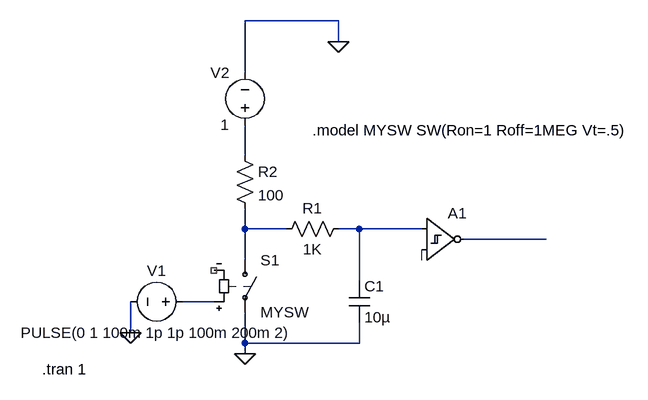
[diagram p0: schematic switch debouncing circuit.asc]
switch debouncing circuit.asc, the LTspice schematic file:
Version 4
SHEET 1 900 680
WIRE 400 -320 256 -320
WIRE 400 -288 400 -320
WIRE 256 -240 256 -320
WIRE 256 -112 256 -160
WIRE 256 0 256 -32
WIRE 320 0 256 0
WIRE 432 0 400 0
WIRE 528 0 432 0
WIRE 720 16 592 16
WIRE 256 48 256 0
WIRE 432 80 432 0
WIRE 208 112 160 112
WIRE 80 160 80 112
WIRE 256 176 256 128
WIRE 432 176 432 144
WIRE 432 176 256 176
WIRE 256 192 256 176
FLAG 80 160 0
FLAG 256 192 0
FLAG 400 -288 0
SYMBOL voltage 176 112 R90
WINDOW 0 -32 56 VBottom 2
WINDOW 3 32 56 VTop 2
WINDOW 123 0 0 Left 0
WINDOW 39 0 0 Left 0
SYMATTR InstName V1
SYMATTR Value PULSE(0 1 100m 1p 1p 100m 200m 2)
SYMBOL cap 416 80 R0
SYMATTR InstName C1
SYMATTR Value 10µ
SYMATTR SpiceLine V=2.5 Irms=0 Rser=0 Lser=0 mfg="Murata" pn="GRM155R60E106ME16" type="X5R"
SYMBOL res 416 -16 R90
WINDOW 0 0 56 VBottom 2
WINDOW 3 32 56 VTop 2
SYMATTR InstName R1
SYMATTR Value 1K
SYMATTR SpiceLine tol=1 pwr=0.1
SYMBOL res 240 -128 R0
SYMATTR InstName R2
SYMATTR Value 100
SYMBOL voltage 256 -144 R180
WINDOW 0 24 96 Left 2
WINDOW 3 24 16 Left 2
WINDOW 123 0 0 Left 0
WINDOW 39 0 0 Left 0
SYMATTR InstName V2
SYMATTR Value 1
SYMBOL Digital\\diffschmtinv 528 -48 R0
SYMATTR InstName A1
SYMBOL sw 256 32 R0
SYMATTR InstName S1
SYMATTR Value MYSW
TEXT -56 216 Left 2 !.tran 1
TEXT 360 -152 Left 2 !.model MYSW SW(Ron=1 Roff=1MEG Vt=.5)

The netlist it stands for:
* switch debouncing circuit.asc
V1 N005 0 PULSE(0 1 100m 1p 1p 100m 200m 2)
C1 N003 0 10µ V=2.5 Irms=0 Rser=0 Lser=0 mfg="Murata" pn="GRM155R60E106ME16" type="X5R"
R1 N003 N002 1K tol=1 pwr=0.1
R2 N001 N002 100
V2 N001 0 1
A1 N003 0 0 0 0 N004 0 0 SCHMITT
S1 N002 0 N005 NC_01 MYSW
.tran 1
.model MYSW SW(Ron=1 Roff=1MEG Vt=.5)
.backanno
.end